# EAGLE schematic DEPDisc experimental v5 (EAGLE 9.7.0)
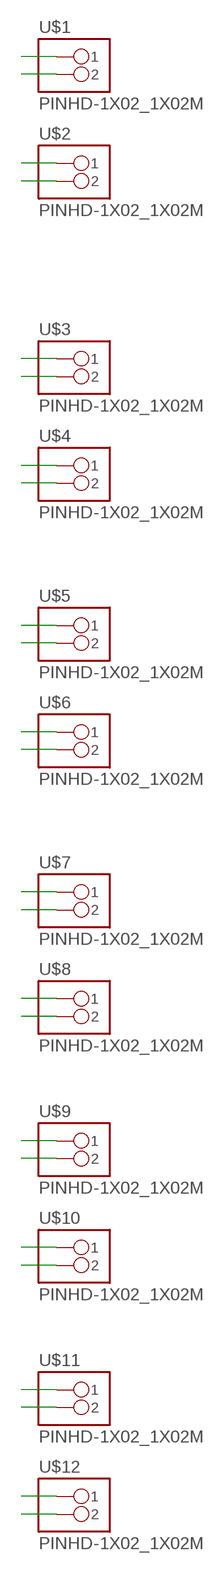
[diagram p0: schematic, sheet 1]

## Parts
U$1  PINHD-1X02_1X02M  [1X02]
U$2  PINHD-1X02_1X02M  [1X02]
U$3  PINHD-1X02_1X02M  [1X02]
U$4  PINHD-1X02_1X02M  [1X02]
U$5  PINHD-1X02_1X02M  [1X02]
U$6  PINHD-1X02_1X02M  [1X02]
U$7  PINHD-1X02_1X02M  [1X02]
U$8  PINHD-1X02_1X02M  [1X02]
U$9  PINHD-1X02_1X02M  [1X02]
U$10  PINHD-1X02_1X02M  [1X02]
U$11  PINHD-1X02_1X02M  [1X02]
U$12  PINHD-1X02_1X02M  [1X02]

## Nets
N$1: U$1.1
N$2: U$1.2
N$3: U$2.1
N$4: U$2.2
N$5: U$3.1
N$6: U$3.2
N$7: U$4.1
N$8: U$4.2
N$9: U$5.1
N$10: U$5.2
N$11: U$6.1
N$12: U$6.2
N$13: U$7.1
N$14: U$7.2
N$15: U$8.1
N$17: U$9.1
N$18: U$9.2
N$19: U$10.1
N$20: U$10.2
N$21: U$11.1
N$22: U$11.2
N$23: U$12.1
N$24: U$12.2
N$40: U$8.2

## Library data of the parts
U$1-U$12 = Tinkercad:PINHD-1X02